# EAGLE schematic crystal-panel (EAGLE 5.07)
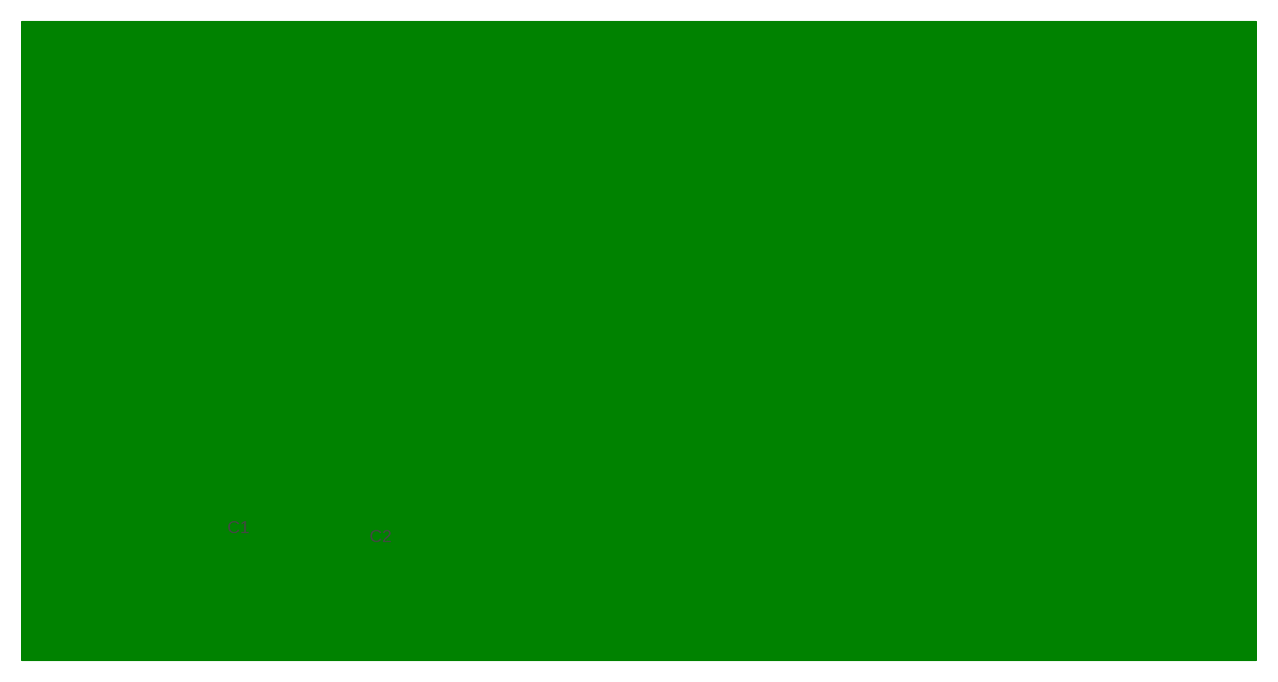
[diagram p0: schematic, sheet 1]

## Parts
C1  C-TRIMMCD-10  [CERMIT-DIE-10MM]
C2  C-TRIMMCD-5  [CERMIT-DIE-5MM]
U$2  SHAFT-PANEL-CBM-TUNE-CAP  [CBM-CAP]
U$3  SHAFT-PANEL-FUDAN-AIR-TUNE-CAP  [AIE-TUNE-CAP-FUDAN]
Unconnected: C1.P$1(A) C1.P$2(E) C2.P$1(A) C2.P$2(E)

## Library data of the parts
C1 C2 = dtoy-RF:C-TRIMM: Trimm capacitor CD-10: cermit dielectric c-trimmer , by Hyl, 2011.4.8
U$2 U$3 = dtoy-RF:SHAFT-PANEL: Shaft Panel for pannel design, mount hole for POT, C-trime, Tune Aire cap, etc. Copyright by hyl , 2011.4.8